# Altium schematic sheet 主底板.SchDoc
size A4
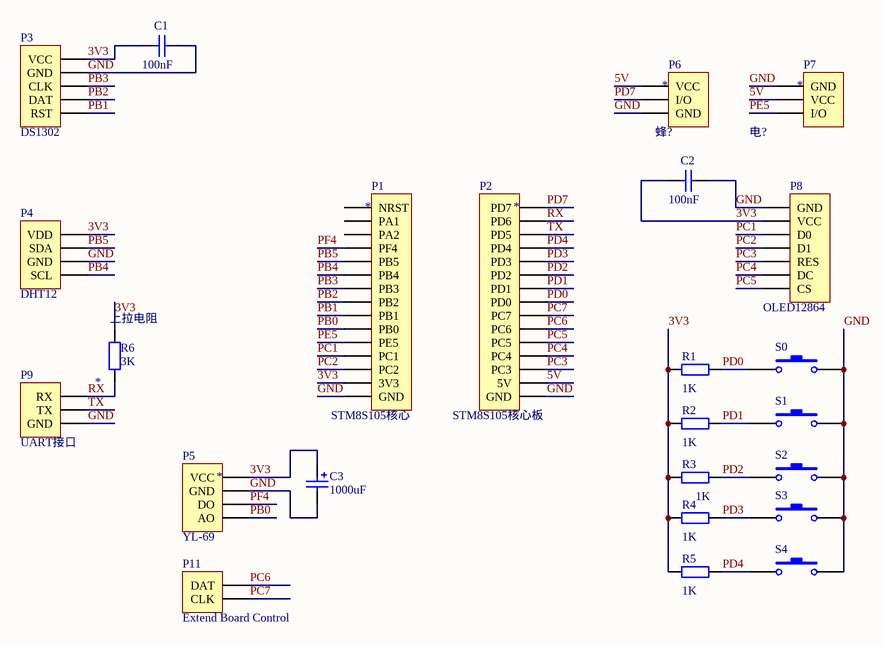
[diagram p0: 主底板.SchDoc]

## Parts
C1  value 100nF  [RAD-0.3]  (hidden comment: Cap)
C2  value 100nF  [RAD-0.3]  (hidden comment: Cap)
C3  value 1000uF  [POLAR0.8]  (hidden comment: Cap Pol2)
P1  *  [MHDR1X15]
P2  *  [MHDR1X15]
P3  DS1302  [MHDR1X5]
P4  DHT12  [MHDR1X4]
P5  *  [MHDR1X4]
P6  *  [MHDR1X3]
P7  *  [MHDR1X3]
P8  OLED12864  [MHDR1X7]
P9  UART接口  [HDR1X3]
P11  Extend Board Control  [HDR1X2]
R1  value 1K  [AXIAL-0.4]  (hidden comment: Res2)
R2  value 1K  [AXIAL-0.4]  (hidden comment: Res2)
R3  value 1K  [AXIAL-0.4]  (hidden comment: Res2)
R4  value 1K  [AXIAL-0.4]  (hidden comment: Res2)
R5  value 1K  [AXIAL-0.4]  (hidden comment: Res2)
R6  *  value 3K  [AXIAL-0.4]
S0  SW-PB  [SPST-2]  (value not drawn)
S1  SW-PB  [SPST-2]  (value not drawn)
S2  SW-PB  [SPST-2]  (value not drawn)
S3  SW-PB  [SPST-2]  (value not drawn)
S4  SW-PB  [SPST-2]  (value not drawn)

## Nets
3V3: C1.1 C2.1 C3.1 P1.14(3V3) P3.1(VCC) P4.1(VDD) P5.1(VCC) P8.2(VCC) R1.1 R2.1 R3.1 R4.1 R5.1 R6.2
5V: P2.14(5V) P6.1(VCC) P7.2(VCC)
GND: C1.2 C2.2 C3.2 P1.15(GND) P2.15(GND) P3.2(GND) P4.3(GND) P5.2(GND) P6.3(GND) P7.1(GND) P8.1(GND) P9.3(GND) S0.2 S1.2 S2.2 S3.2 S4.2
PB0: P1.10(PB0) P5.4(AO)
PB1: P1.9(PB1) P3.5(RST)
PB2: P1.8(PB2) P3.4(DAT)
PB3: P1.7(PB3) P3.3(CLK)
PB4: P1.6(PB4) P4.4(SCL)
PB5: P1.5(PB5) P4.2(SDA)
PC1: P1.12(PC1) P8.3(D0)
PC2: P1.13(PC2) P8.4(D1)
PC3: P2.13(PC3) P8.5(RES)
PC4: P2.12(PC4) P8.6(DC)
PC5: P2.11(PC5) P8.7(CS)
PC6: P2.10(PC6) P11.1(DAT)
PC7: P2.9(PC7) P11.2(CLK)
PD0: P2.8(PD0) R1.2 S0.1
PD1: P2.7(PD1) R2.2 S1.1
PD2: P2.6(PD2) R3.2 S2.1
PD3: P2.5(PD3) R4.2 S3.1
PD4: P2.4(PD4) R5.2 S4.1
PD7: P2.1(PD7) P6.2(I/O)
PE5: P1.11(PE5) P7.3(I/O)
PF4: P1.4(PF4) P5.3(DO)
RX: P2.2(PD6) P9.1(RX) R6.1
TX: P2.3(PD5) P9.2(TX)

Not connected (* = marked no-connect by the designer): P1 1(NRST) 2(PA1) 3(PA2)

## Notes on the sheet
- (in symbol MHDR1X3) 蜂?; 电?
- (in symbol MHDR1X4) YL-69
- (in symbol MHDR1X15) STM8S105核心; STM8S105核心板
- (in symbol Res2) 上拉电阻

## Library data of the parts
C1 C2 = Cap: Capacitor; Published: 8-Jun-2000; LatestRevisionDate: 17-Jul-2002; LatestRevisionNote: Re-released for DXP Platform.; PackageReference: RAD-0.3; Publisher: Altium Limited; PackageDescription: Radial Cap, Thru-Hole; 2 Leads; 0.3 in Pin Spacing
C3 = Cap Pol2: Polarized Capacitor (Axial); Published: 8-Jun-2000; LatestRevisionDate: 17-Jul-2002; LatestRevisionNote: Re-released for DXP Platform.; PackageReference: POLAR0.8; Publisher: Altium Limited; PackageDescription: Polarized Capacitor; 2 Leads
P1 P2 = MHDR1X15: Header, 15-Pin; LatestRevisionDate: 17-Jul-2002; LatestRevisionNote: Re-released for DXP Platform.; Publisher: Altium Limited
P3 = MHDR1X5: Header, 5-Pin; LatestRevisionDate: 17-Jul-2002; LatestRevisionNote: Re-released for DXP Platform.; Publisher: Altium Limited
P4 P5 = MHDR1X4: Header, 4-Pin; LatestRevisionDate: 17-Jul-2002; LatestRevisionNote: Re-released for DXP Platform.; Publisher: Altium Limited
P6 P7 = MHDR1X3: Header, 3-Pin; LatestRevisionDate: 17-Jul-2002; LatestRevisionNote: Re-released for DXP Platform.; Publisher: Altium Limited
P8 = MHDR1X7: Header, 7-Pin; LatestRevisionDate: 17-Jul-2002; LatestRevisionNote: Re-released for DXP Platform.; Publisher: Altium Limited
P9 = Header 3: Header, 3-Pin; LatestRevisionDate: 17-Jul-2002; LatestRevisionNote: Re-released for DXP Platform.; Publisher: Altium Limited
P11 = Header 2: Header, 2-Pin; LatestRevisionDate: 17-Jul-2002; LatestRevisionNote: Re-released for DXP Platform.; Publisher: Altium Limited
R1-R6 = Res2: Resistor; Published: 8-Jun-2000; LatestRevisionDate: 17-Jul-2002; LatestRevisionNote: Re-released for DXP Platform.; PackageReference: AXIAL-0.4; Publisher: Altium Limited; PackageDescription: Axial Device, Thru-Hole; 2 Leads; 0.4 in Pin Spacing
S0-S4 = SW-PB: Switch; Published: 24-Mar-1999; LatestRevisionDate: 17-Jul-2002; LatestRevisionNote: Re-released for DXP Platform.; PackageReference: SPST-2; Publisher: Altium Limited; PackageDescription: Switch; 2 Leads